# EAGLE design tricolormini (EAGLE 7.2.0)
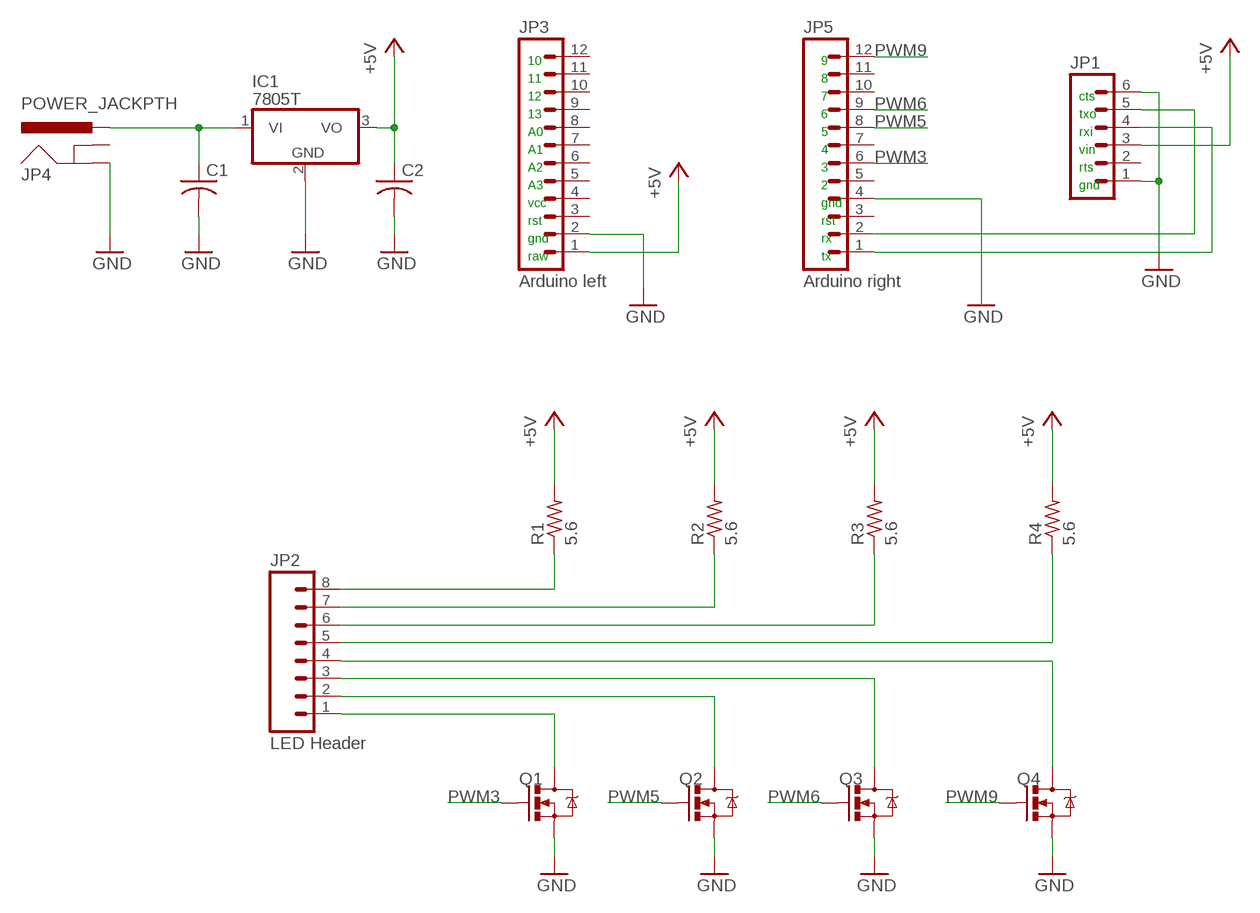
[diagram p0: schematic, sheet 1]

## Parts
C1  C-USC1206  [C1206]
C2  C-USC1206  [C1206]
IC1  7805T  [TO220H]
JP1  M06SILK_FEMALE_PTH  [1X06]
JP2  LED Header  M08  [1X08_ROUND]
JP3  Arduino left  M12PTH  [1X12]
JP4  POWER_JACKPTH  [POWER_JACK_PTH]
JP5  Arduino right  M12PTH  [1X12]
Q1  MOSFET-NCHANNELAO3404A  [SOT23-3]
Q2  MOSFET-NCHANNELAO3404A  [SOT23-3]
Q3  MOSFET-NCHANNELAO3404A  [SOT23-3]
Q4  MOSFET-NCHANNELAO3404A  [SOT23-3]
R1  5.6  R-US_0207/10  [0207/10]
R2  5.6  R-US_0207/10  [0207/10]
R3  5.6  R-US_0207/10  [0207/10]
R4  5.6  R-US_0207/10  [0207/10]

## Nets
+5V: C2.1 IC1.3(VO) JP1.3 JP3.1 R1.2 R2.2 R3.2 R4.2
GND: C1.2 C2.2 IC1.2(GND) JP1.1 JP1.6 JP3.2 JP4.GND JP5.4 Q1.2(S) Q2.2(S) Q3.2(S) Q4.2(S)
N$1: C1.1 IC1.1(VI) JP4.PWR
N$3: JP2.1 Q1.3(D)
N$4: JP2.2 Q2.3(D)
N$5: JP2.3 Q3.3(D)
N$6: JP2.4 Q4.3(D)
N$7: JP2.8 R1.1
N$8: JP2.7 R2.1
N$9: JP2.6 R3.1
N$10: JP2.5 R4.1
N$11: JP1.5 JP5.2
N$12: JP1.4 JP5.1
PWM3: JP5.6 Q1.1(G)
PWM5: JP5.8 Q2.1(G)
PWM6: JP5.9 Q3.1(G)
PWM9: JP5.12 Q4.1(G)
Unconnected: JP1.2 JP3.3 JP3.4 JP3.5 JP3.6 JP3.7 JP3.8 JP3.9 JP3.10 JP3.11 JP3.12 JP4.GNDBREAK JP5.3 JP5.5 JP5.7 JP5.10 JP5.11

## Notes on the sheet
- 10 | 9
- 11 | 8
- 12 | 7 | cts
- 13 | 6 | txo
- A0 | 5 | rxi
- A1 | 4 | vin
- A2 | 3 | rts
- A3 | 2 | gnd
- vcc | gnd
- rst | rst
- gnd | rx
- raw | tx

## Library data of the parts
C1 C2 = resistor:C-US: CAPACITOR, American symbol
IC1 = linear:78*: Positive VOLTAGE REGULATOR Source: http://cache.national.com/ds/LM/LM78L05.pdf http://www.fairchildsemi.com/ds/LM/LM7805.pdf
JP1 = SparkFun-Connectors:M06: Header 6 Standard 6-pin 0.1" header. Use with straight break away headers (SKU : PRT-00116), right angle break away headers (PRT-00553), swiss pins (PRT-00743), machine pins (PRT-00117), and female headers (PRT-00115). Molex polarized connector foot print use with SKU : PRT-08094 with associated crimp pins and housings. NOTES ON THE VARIANTS LOCK and LOCK_LONGPADS... This footprint was designed to help hold the alignment of a through-hole component (i.e. 6-pin header) while soldering it into place. You may notice that each hole has been shifted either up or down by 0.005 of an inch from it's more standard position (which is a perfectly straight line). This slight alteration caused the pins (the squares in the middle) to touch the edges of the holes. Because they are alternating, it causes a "brace" to hold the component in place. 0.005 has proven to be the perfect amount of "off-center" position when using our standard breakaway headers. Although looks a little odd when you look at the bare footprint, once you have a header in there, the alteration is very hard to notice. Also,if you push a header all the way into place, it is covered up entirely on the bottom side. This idea of altering the position of holes to aid alignment will be further integrated into the Sparkfun Library for other footprints. It can help hold any component with 3 or more connection pins.; PROD_ID: CONN-08437
JP2 = SparkFun-Connectors:M08: Header 8 Standard 8-pin 0.1" header. Use with straight break away headers (SKU : PRT-00116), right angle break away headers (PRT-00553), swiss pins (PRT-00743), machine pins (PRT-00117), and female headers (PRT-00115).
JP3 JP5 = SparkFun-Connectors:M12: Header 12 Standard 12-pin 0.1" header. Use with straight break away headers (SKU : PRT-00116), right angle break away headers (PRT-00553), swiss pins (PRT-00743), machine pins (PRT-00117), and female headers (PRT-00115).
JP4 = SparkFun-Connectors:POWER_JACK: Power Jack This is the standard 5.5mm barrel jack for power. The PTH is the most common, proven, reliable, footprint. The Slot footprint only works if the mill layer is transmitted to the PCB fab house so be warned. Mating wall wart : TOL-00298 (and others); PROD_ID: CONN-08197
Q1-Q4 = SparkFun-DiscreteSemi:MOSFET-NCHANNEL: Common NMOSFET Parts MFG P/N Store ID Prod ID FDD8780 TRANS-09984 SI7820DN TRANS-11055 FDS6630A IC-08089 2N7002PW TRANS-11151 FQP30N06L COM-10213 TRANS-10060 BSS123LT1G TRANS-08345 BSS138 TRANS-00830 BS170 2N7000; PROD_ID: TRAN-12988
R1-R4 = resistor:R-US_: RESISTOR, American symbol

## Net classes
0 default: width 0.406 mm, clearance 0.406 mm

## Board
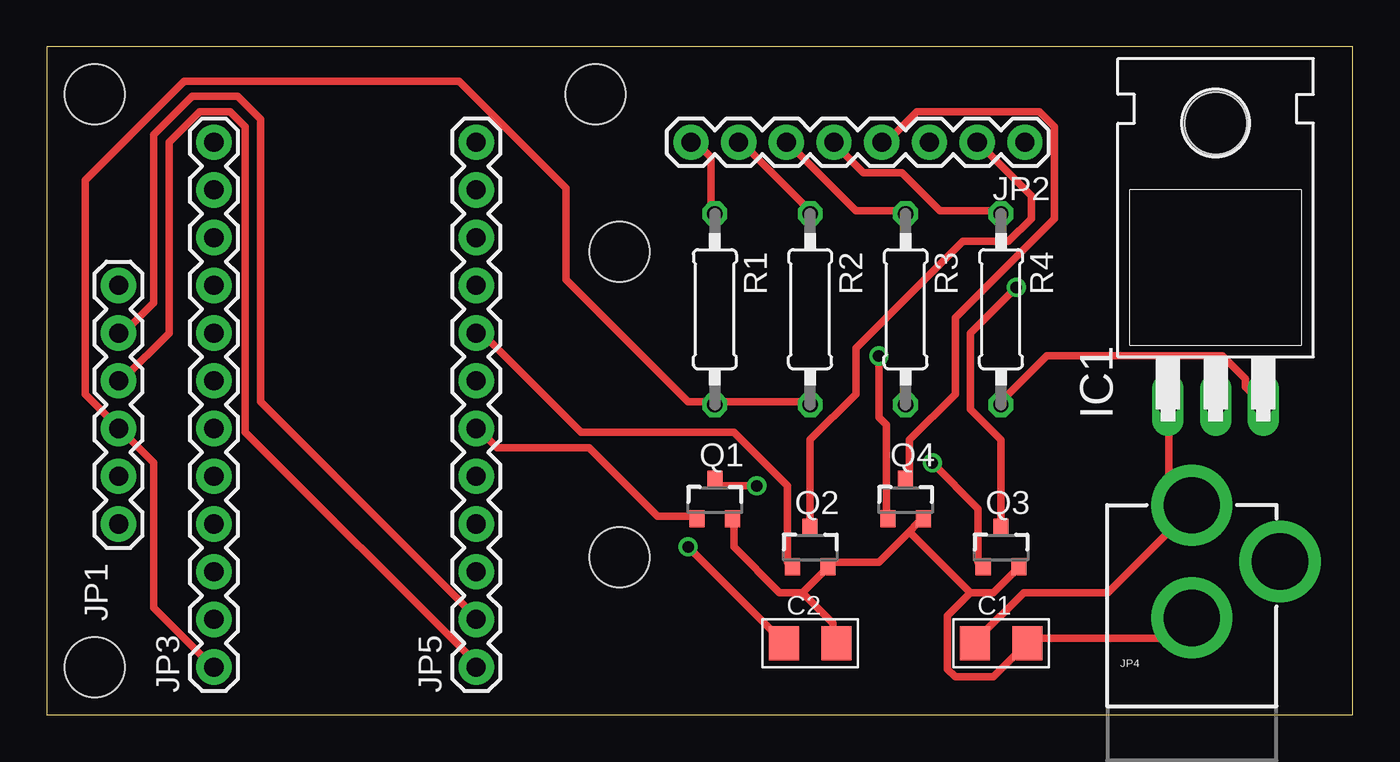
[diagram p1: board, top side]
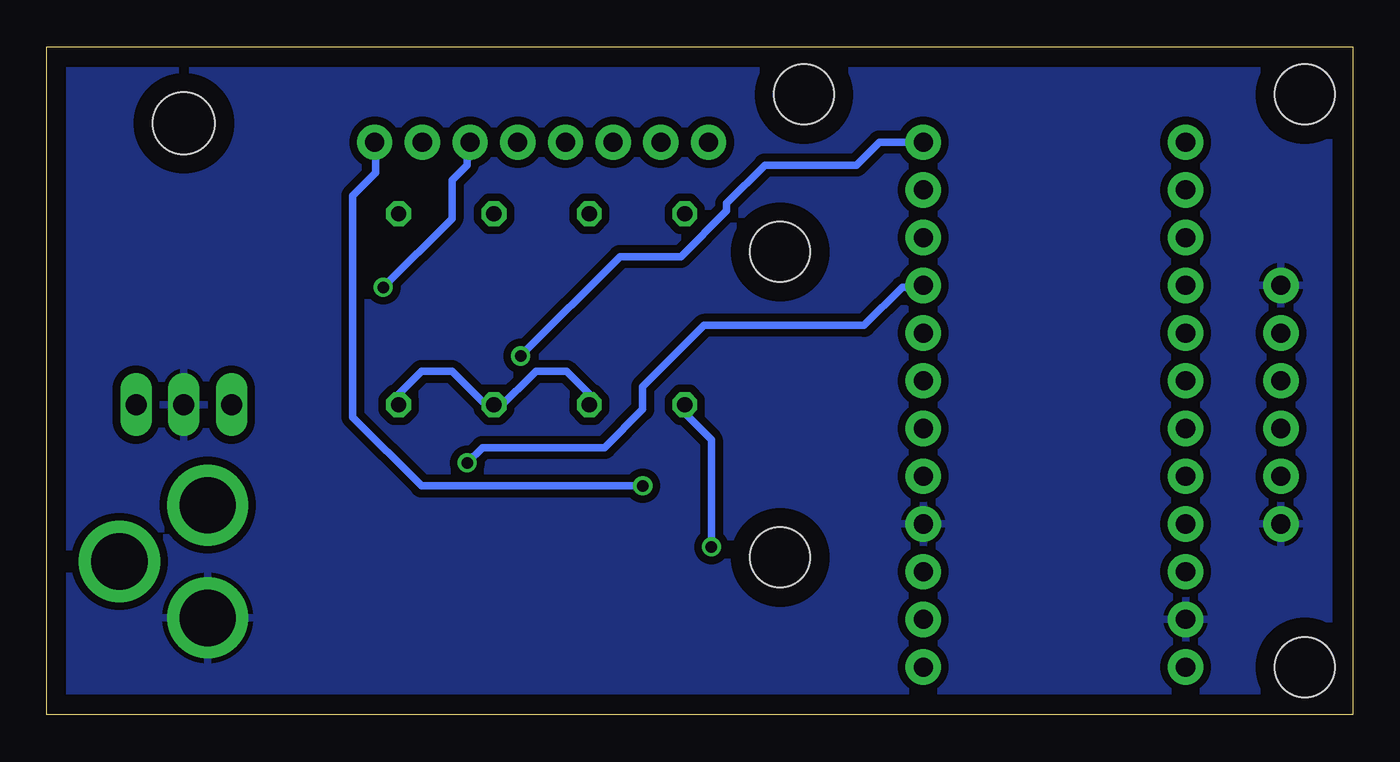
[diagram p2: board, bottom side, seen from below]

Size 69.52 x 35.55 mm. Coordinates in mm from the lower left corner, seen from the top.
Outline: 0,0 69.52,0 69.52,35.55 0,35.55 0,0
Copper layers (1*16): Top 0.035mm / dielectric 1.5mm / Bottom 0.035mm
Design rules "default": minimum track width 10mil, minimum drill 24mil, track to track 8mil, track to pad 8mil, pad to pad 8mil, via to via 8mil, smd to smd 8mil, copper to edge 40mil, drill to drill 8mil, minimum pad ring 10mil, minimum via ring 8mil, stop-mask expansion 4mil, vias tented up to drill 0mil, thermal gap 10mil
Holes 3.2 mm at 30.48,24.64 30.48,8.38 2.54,33.02 2.54,2.54 29.21,33.02

### Footprints (pad centres in the part's own frame; a part is rotated, then mirrored left to right if it is on the bottom)
C1206 = smd 1.6 x 1.8: 1 -1.4,0; 2 1.4,0
TO220H = drill 1.118 long: 1 -2.54,-10.16; 2 0,-10.16; 3 2.54,-10.16 | hole 3.302: 0,4.826
1X06 = drill 1.016 pad 1.88: 1 0,0; 2 2.54,0; 3 5.08,0; 4 7.62,0; 5 10.16,0; 6 12.7,0
1X08_ROUND = drill 1.016 pad 1.88: 1 0,0; 2 2.54,0; 3 5.08,0; 4 7.62,0; 5 10.16,0; 6 12.7,0; 7 15.24,0; 8 17.78,0
1X12 = drill 1.016 pad 1.88: 1 0,0; 2 2.54,0; 3 5.08,0; 4 7.62,0; 5 10.16,0; 6 12.7,0; 7 15.24,0; 8 17.78,0; 9 20.32,0; 10 22.86,0; 11 25.4,0; 12 27.94,0
POWER_JACK_PTH = drill 2.997 pad 4.318: GND 0,7.7; GNDBREAK 4.7,10.7; PWR 0,13.7
SOT23-3 = smd 0.8 x 0.9: 1 -0.95,-1; 2 0.95,-1; 3 0,1.1
0207/10 = drill 0.813 octagon: 1 -5.08,0; 2 5.08,0

### Placement (x,y rotation side)
C1  50.8,3.81 0 top
C2  40.64,3.81 0 top
IC1  62.23,26.67 0 top
JP1  3.81,10.16 90 top
JP2  52.07,30.48 180 top
JP3  8.89,2.54 90 top
JP4  60.96,-2.54 0 top
JP5  22.86,2.54 90 top
Q1  35.56,11.43 0 top
Q2  40.64,8.89 0 top
Q3  50.8,8.89 0 top
Q4  45.72,11.43 0 top
R1  35.56,21.59 270 top
R2  40.64,21.59 270 top
R3  45.72,21.59 270 top
R4  50.8,21.59 270 top

### Tracks (layer width: path | path; a pad name or v marks a point on that pad's centre or on a via)
+5V  (via drill 0.61)
  Top 0.406: JP3.1 8.53,2.85 5.69,5.69 5.69,13.41 4.06,15.04 JP1.3 3.66,15.44 2.03,17.07 2.03,28.45 7.32,33.73 21.95,33.73 27.64,28.04 27.64,23.16 34.14,16.66 35.36,16.66 R1.2 35.76,16.66 40.64,16.66 R2.2 | v34.14,8.94 39.01,4.06 C2.1 | IC1.3 63.8,17.48 63.8,17.88 62.59,19.1 53.24,19.1 50.8,16.66 R4.2
  Bottom 0.406: v34.14,8.94 34.14,14.63 35.76,16.26 R1.2 | R4.2 50.8,16.26 51.21,16.66 49.58,18.29 47.95,18.29 46.33,16.66 45.92,16.66 R3.2 45.52,16.26 43.48,18.29 41.86,18.29 40.64,17.07 R2.2
GND
  Top 0.406: JP4.GND 60.96,4.88 60.15,4.06 52.43,4.06 C1.2 52.02,3.66 50.39,2.03 48.36,2.03 47.95,2.44 47.95,5.28 49.17,6.5 | 40.23,6.5 39.01,6.5 36.58,8.94 36.58,10.16 Q1.2 | 40.23,6.5 41.45,7.72 Q2.2 41.86,8.13 44.3,8.13 45.92,9.75 | 45.92,9.75 46.33,10.16 Q4.2 | 49.17,6.5 50.39,6.5 51.61,7.72 Q3.2 | 45.92,9.75 49.17,6.5 | 40.23,6.5 41.86,4.88 41.86,4.06 C2.2
  pour Bottom: 1.27,34.29 68.58,34.29 68.58,1.27 1.27,1.27
N$1
  Top 0.406: C1.1 49.58,4.06 52.02,6.5 56.49,6.5 60.96,10.97 JP4.PWR 60.96,11.38 59.74,12.6 59.74,16.26 IC1.1
N$3  (via drill 0.61)
  Top 0.406: v37.8,12.19 35.76,12.19 Q1.3
  Bottom 0.406: v37.8,12.19 49.58,12.19 53.24,15.85 53.24,27.64 52.02,28.85 52.02,30.48 JP2.1
N$4
  Top 0.406: Q2.3 40.64,14.63 43.08,17.07 43.08,19.51 48.77,25.2 51.21,25.2 52.43,26.42 52.43,27.64 49.58,30.48 JP2.2
N$5  (via drill 0.61)
  Top 0.406: Q3.3 50.8,14.63 49.17,16.26 49.17,20.32 v51.61,22.76
  Bottom 0.406: v51.61,22.76 47.95,26.42 47.95,28.45 47.14,29.26 47.14,30.48 JP2.3
N$6
  Top 0.406: Q4.3 45.92,12.6 45.92,14.63 48.36,17.07 48.36,21.13 53.65,26.42 53.65,31.29 52.83,32.11 46.33,32.11 44.7,30.48 JP2.4
N$7
  Top 0.406: R1.1 35.36,26.82 35.36,29.67 34.54,30.48 JP2.8
N$8
  Top 0.406: R2.1 40.64,26.82 36.98,30.48 JP2.7
N$9
  Top 0.406: R3.1 45.52,26.82 43.08,26.82 39.42,30.48 JP2.6
N$10
  Top 0.406: R4.1 50.8,26.82 47.55,26.82 45.52,28.85 43.48,28.85 41.86,30.48 JP2.5
N$11
  Top 0.406: JP5.2 22.76,5.28 11.38,16.66 11.38,31.7 10.16,32.92 7.72,32.92 5.69,30.89 5.69,21.95 4.06,20.32 JP1.5
N$12
  Top 0.406: JP5.1 22.76,2.85 10.57,15.04 10.57,31.29 9.75,32.11 8.13,32.11 6.5,30.48 6.5,20.32 4.06,17.88 JP1.4
PWM3
  Top 0.406: Q1.1 34.54,10.57 32.51,10.57 28.85,14.22 23.98,14.22 23.16,15.04 JP5.6
PWM5
  Top 0.406: Q2.1 39.42,8.13 39.42,12.19 36.58,15.04 28.45,15.04 23.16,20.32 JP5.8
PWM6  (via drill 0.61)
  Top 0.406: v47.14,13.41 49.58,10.97 49.58,8.13 Q3.1
  Bottom 0.406: v47.14,13.41 46.33,14.22 39.83,14.22 37.8,16.26 37.8,17.48 34.54,20.73 26.01,20.73 23.98,22.76 23.16,22.76 JP5.9
PWM9  (via drill 0.61)
  Top 0.406: v44.3,19.1 44.3,15.85 44.7,15.44 44.7,10.57 Q4.1
  Bottom 0.406: v44.3,19.1 39.01,24.38 35.76,24.38 33.33,26.82 33.33,27.23 31.29,29.26 26.42,29.26 25.2,30.48 JP5.12